# Altium project Electro_plant.PrjPcb
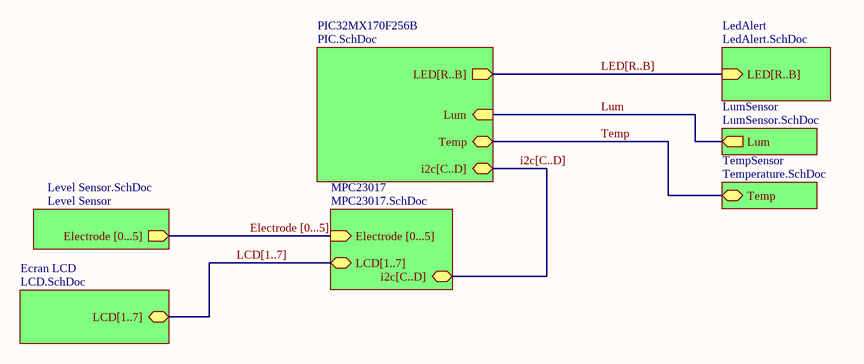
[diagram p0: ElectroPlantoE.SchDoc]
5 sheets, 43 parts. Net scope: hierarchical (ports join the sheet entries above them; power ports are global).
Sheets:
  ElectroPlantoE.SchDoc
    MPC23017 = MPC23017.SchDoc
    Level Sensor = Level Sensor.SchDoc
  BarGraph.SchDoc
  SoilMoisture.SchDoc

## Sheet ElectroPlantoE.SchDoc
size A

### Sub-sheets
Ecran LCD = LCD.SchDoc (file not in this document): LCD[1..7] (bidir)
LedAlert = LedAlert.SchDoc (file not in this document): LED[R..B] (in)
Level Sensor = Level Sensor.SchDoc: Electrode [0...5] (out)
LumSensor = LumSensor.SchDoc (file not in this document): Lum (out)
MPC23017 = MPC23017.SchDoc: i2c[C..D] (bidir), Electrode [0...5] (in), LCD[1..7] (bidir)
PIC32MX170F256B = PIC.SchDoc (file not in this document): LED[R..B] (out), Lum (in), Temp, i2c[C..D] (bidir)
TempSensor = Temperature.SchDoc (file not in this document): Temp (bidir)

### Nets
Lum: sheet PIC32MX170F256B/Lum, sheet LumSensor/Lum
Temp: sheet PIC32MX170F256B/Temp, sheet TempSensor/Temp

### Buses and harness runs
bus Electrode [0...5] = sheet Level Sensor/Electrode [0...5] = sheet MPC23017/Electrode [0...5]
bus i2c[C..D] = sheet MPC23017/i2c[C..D] = sheet PIC32MX170F256B/i2c[C..D]
bus LCD[1..7] = sheet Ecran LCD/LCD[1..7] = sheet MPC23017/LCD[1..7]
bus LED[R..B] = sheet LedAlert/LED[R..B] = sheet PIC32MX170F256B/LED[R..B]

## Sheet MPC23017.SchDoc
size A
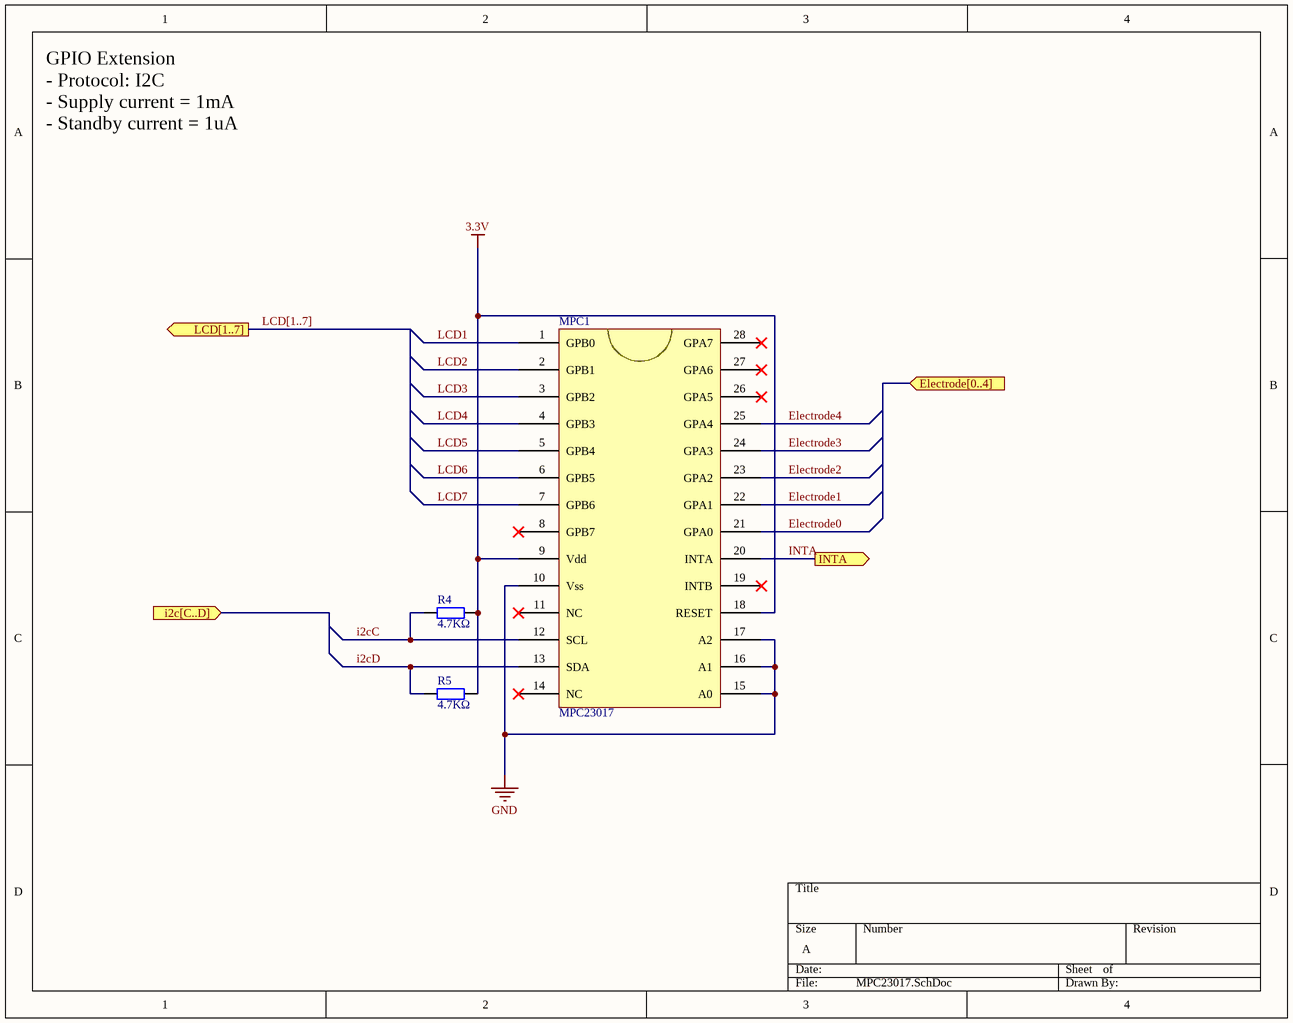
[diagram p1: MPC23017.SchDoc]

### Parts
MPC1  MPC23017
R4  4.7KΩ  [AXIAL-0.4]
R5  4.7KΩ  [AXIAL-0.4]

### Ports
Electrode[0..4] (in), i2c[C..D] (in), INTA (out), LCD[1..7] (out)

### Nets
3.3V: MPC1.9(Vdd) MPC1.10(Vss) MPC1.15(A0) MPC1.16(A1) MPC1.17(A2) MPC1.18(RESET) R4.1 R5.1  [also labelled GND]
Electrode0: MPC1.21(GPA0)
Electrode1: MPC1.22(GPA1)
Electrode2: MPC1.23(GPA2)
Electrode3: MPC1.24(GPA3)
Electrode4: MPC1.25(GPA4)
i2cC: MPC1.12(SCL) R4.2
i2cD: MPC1.13(SDA) R5.2
INTA: MPC1.20(INTA) ; port INTA
LCD1: MPC1.1(GPB0)
LCD2: MPC1.2(GPB1)
LCD3: MPC1.3(GPB2)
LCD4: MPC1.4(GPB3)
LCD5: MPC1.5(GPB4)
LCD6: MPC1.6(GPB5)
LCD7: MPC1.7(GPB6)

Not connected (* = marked no-connect by the designer): MPC1 8(GPB7)* 11(NC)* 14(NC)* 19(INTB)* 26(GPA5)* 27(GPA6)* 28(GPA7)*

### Buses and harness runs
bus LCD[1..7] = port LCD[1..7]

### Notes on the sheet
- GPIO Extension
  - Protocol: I2C
  - Supply current = 1mA
  - Standby current = 1uA

### Library data of the parts
MPC1 = Component_1
R4 R5 = Res2: Resistor; Value: 1K; Published: 8-Jun-2000; LatestRevisionDate: 17-Jul-2002; LatestRevisionNote: Re-released for DXP Platform.; PackageReference: AXIAL-0.4; Publisher: Altium Limited; PackageDescription: Axial Device, Thru-Hole; 2 Leads; 0.4 in Pin Spacing

## Sheet Level Sensor.SchDoc
size A
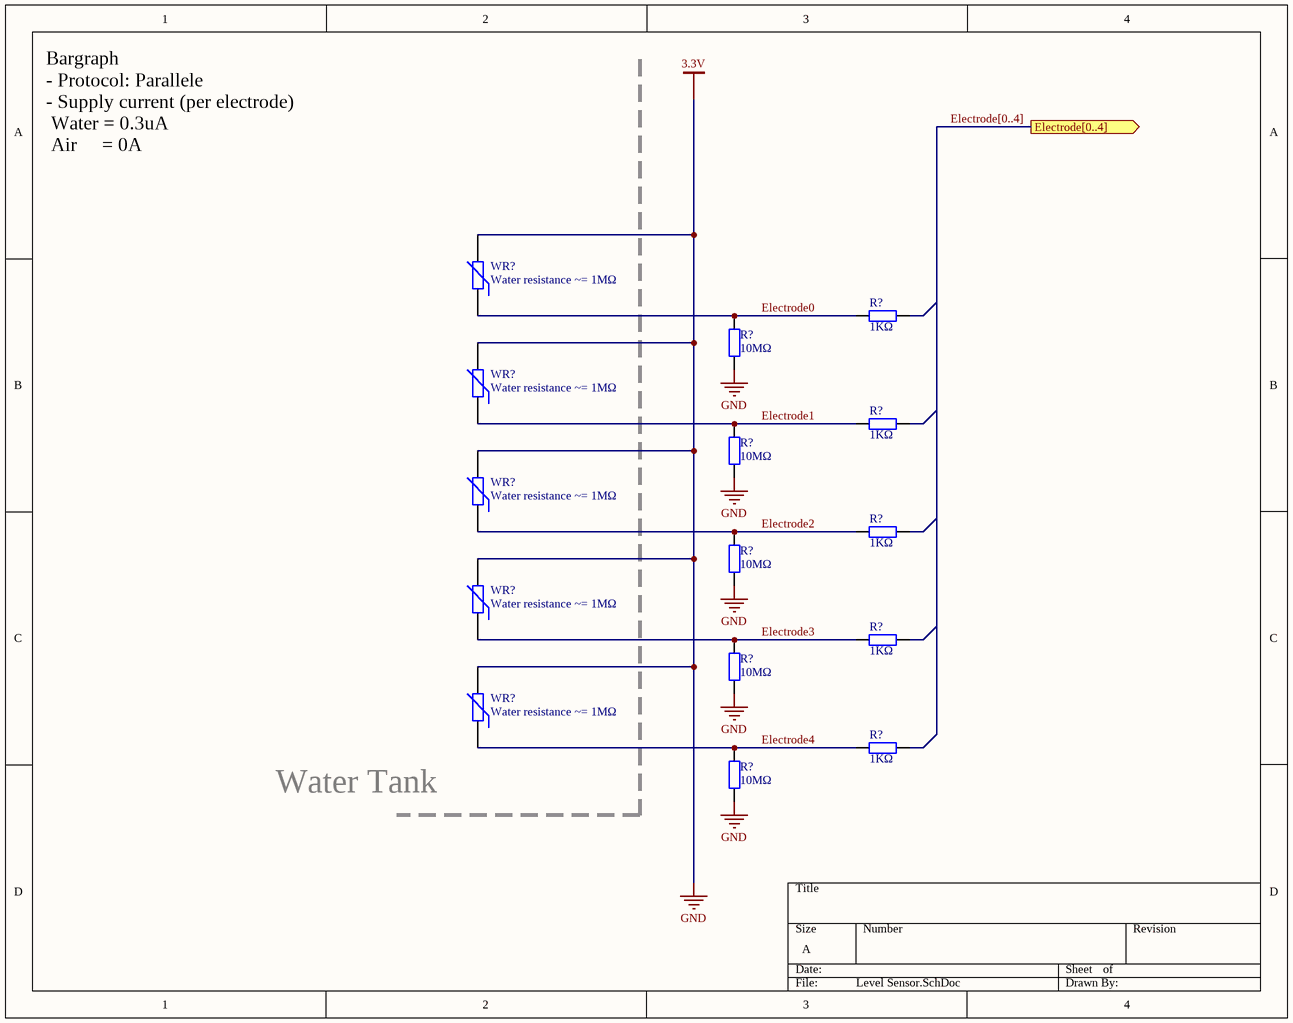
[diagram p2: Level Sensor.SchDoc]

### Parts
(Parts that share a designator on the sheet are numbered #1, #2 ... from top to bottom, then left to right.)
R?#1  1KΩ  [AXIAL-0.4]
R?#2  10MΩ  [AXIAL-0.4]
R?#3  1KΩ  [AXIAL-0.4]
R?#4  10MΩ  [AXIAL-0.4]
R?#5  1KΩ  [AXIAL-0.4]
R?#6  10MΩ  [AXIAL-0.4]
R?#7  1KΩ  [AXIAL-0.4]
R?#8  10MΩ  [AXIAL-0.4]
R?#9  1KΩ  [AXIAL-0.4]
R?#10  10MΩ  [AXIAL-0.4]
WR?#1  Water resistance ~= 1MΩ  [6-0805_N]
WR?#2  Water resistance ~= 1MΩ  [6-0805_N]
WR?#3  Water resistance ~= 1MΩ  [6-0805_N]
WR?#4  Water resistance ~= 1MΩ  [6-0805_N]
WR?#5  Water resistance ~= 1MΩ  [6-0805_N]

### Ports
Electrode[0..4] (out)

### Nets
3.3V: R?#2.1 R?#4.1 R?#6.1 R?#8.1 R?#10.1 WR?#1.2 WR?#2.2 WR?#3.2 WR?#4.2 WR?#5.2  [also labelled GND]
Electrode0: R?#1.2 R?#2.2 WR?#1.1
Electrode1: R?#3.2 R?#4.2 WR?#2.1
Electrode2: R?#5.2 R?#6.2 WR?#3.1
Electrode3: R?#7.2 R?#8.2 WR?#4.1
Electrode4: R?#9.2 R?#10.2 WR?#5.1

Not connected (* = marked no-connect by the designer): R?#1 1; R?#3 1; R?#5 1; R?#7 1; R?#9 1

### Buses and harness runs
bus Electrode[0..4] = port Electrode[0..4]

### Notes on the sheet
- Bargraph
  - Protocol: Parallele
  - Supply current (per electrode)
  Water = 0.3uA
  Air     = 0A
- Water Tank

### Library data of the parts
R?#1-R?#10 = Res2: Resistor; Value: 1K; Published: 8-Jun-2000; LatestRevisionDate: 17-Jul-2002; LatestRevisionNote: Re-released for DXP Platform.; PackageReference: AXIAL-0.4; Publisher: Altium Limited; PackageDescription: Axial Device, Thru-Hole; 2 Leads; 0.4 in Pin Spacing
WR?#1-WR?#5 = Res Varistor: Varistor (Voltage-Sensitive Resistor); Published: 24-Mar-1999; LatestRevisionDate: 29-May-2009; LatestRevisionNote: IPC-7351 Footprint Added.; PackageVersion: Mar-2003; PackageReference: 6-0805; Publisher: Altium Limited; PackageDescription: Chip Resistor 0805 Case Size; Code_IPC: RESC2012

## Sheet BarGraph.SchDoc
size A
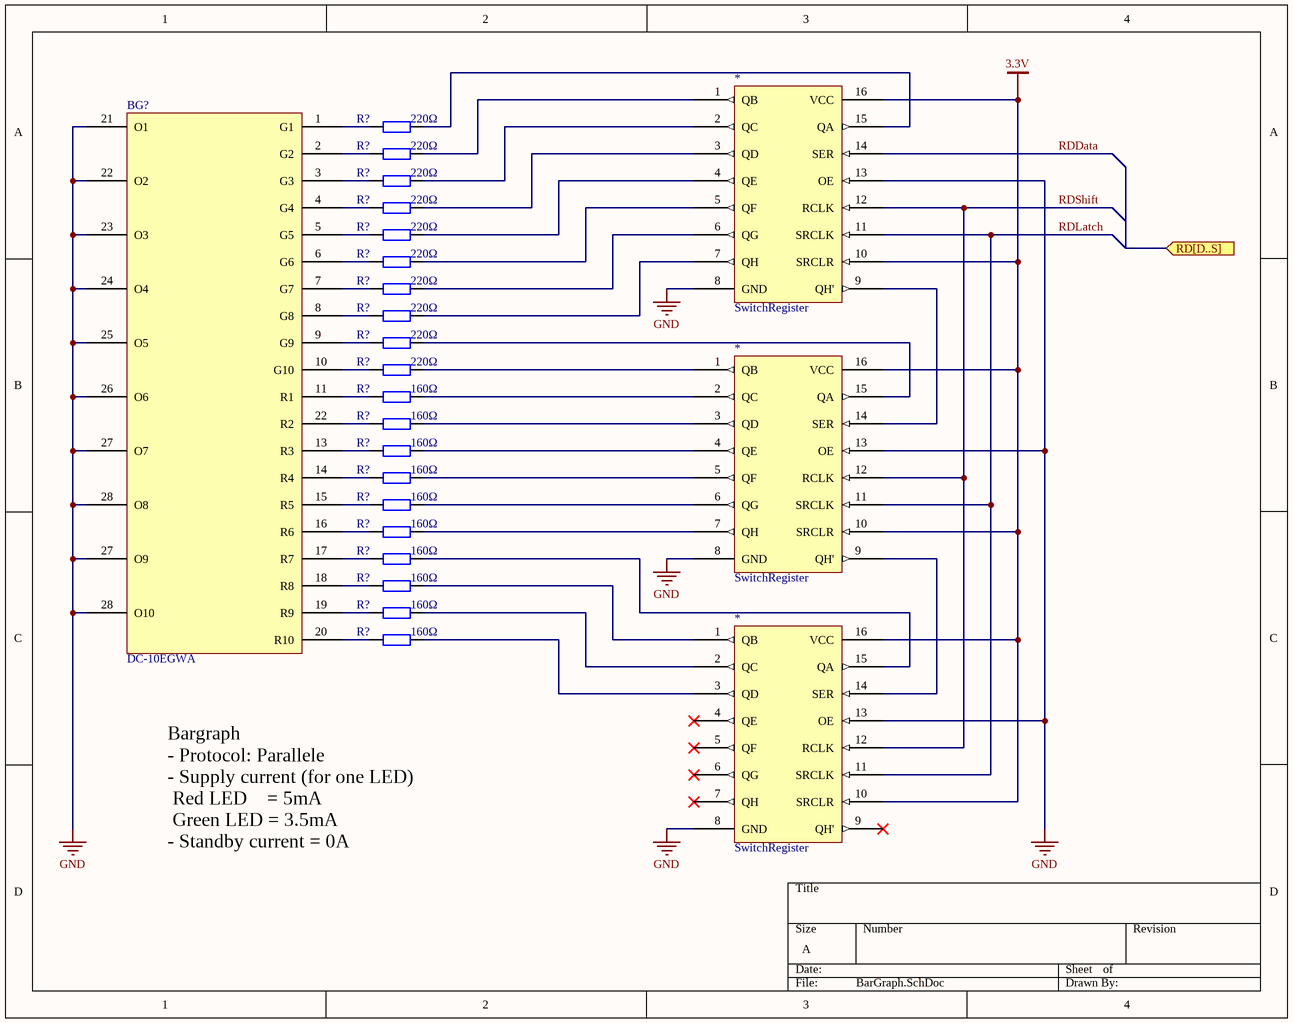
[diagram p3: BarGraph.SchDoc]

### Parts
(Parts that share a designator on the sheet are numbered #1, #2 ... from top to bottom, then left to right.)
*#1  SwitchRegister
*#2  SwitchRegister
*#3  SwitchRegister
BG?  DC-10EGWA
R?#11  220Ω  [AXIAL-0.4]
R?#12  220Ω  [AXIAL-0.4]
R?#13  220Ω  [AXIAL-0.4]
R?#14  220Ω  [AXIAL-0.4]
R?#15  220Ω  [AXIAL-0.4]
R?#16  220Ω  [AXIAL-0.4]
R?#17  220Ω  [AXIAL-0.4]
R?#18  220Ω  [AXIAL-0.4]
R?#19  220Ω  [AXIAL-0.4]
R?#20  220Ω  [AXIAL-0.4]
R?#21  160Ω  [AXIAL-0.4]
R?#22  160Ω  [AXIAL-0.4]
R?#23  160Ω  [AXIAL-0.4]
R?#24  160Ω  [AXIAL-0.4]
R?#25  160Ω  [AXIAL-0.4]
R?#26  160Ω  [AXIAL-0.4]
R?#27  160Ω  [AXIAL-0.4]
R?#28  160Ω  [AXIAL-0.4]
R?#29  160Ω  [AXIAL-0.4]
R?#30  160Ω  [AXIAL-0.4]

### Ports
RD[D..S] (in)

### Nets
3.3V: *#1.8(GND) *#1.10(SRCLR) *#1.13(OE) *#1.16(VCC) *#2.8(GND) *#2.10(SRCLR) *#2.13(OE) *#2.16(VCC) *#3.8(GND) *#3.10(SRCLR) *#3.13(OE) *#3.16(VCC) BG?.21(O1) BG?.22(O2) BG?.23(O3) BG?.24(O4) BG?.25(O5) BG?.26(O6) BG?.27(O7) BG?.28(O8)  [also labelled GND]
RDData: *#1.14(SER)
RDLatch: *#1.11(SRCLK) *#2.11(SRCLK) *#3.11(SRCLK)
RDShift: *#1.12(RCLK) *#2.12(RCLK) *#3.12(RCLK)
Net*#1_1: *#1.1(QB) R?#12.2
Net*#1_2: *#1.2(QC) R?#13.2
Net*#1_3: *#1.3(QD) R?#14.2
Net*#1_4: *#1.4(QE) R?#15.2
Net*#1_5: *#1.5(QF) R?#16.2
Net*#1_6: *#1.6(QG) R?#17.2
Net*#1_7: *#1.7(QH) R?#18.2
Net*#1_9: *#1.9(QH') *#2.14(SER)
Net*#1_15: *#1.15(QA) R?#11.2
Net*#2_1: *#2.1(QB) R?#20.2
Net*#2_2: *#2.2(QC) R?#21.2
Net*#2_3: *#2.3(QD) R?#22.2
Net*#2_4: *#2.4(QE) R?#23.2
Net*#2_5: *#2.5(QF) R?#24.2
Net*#2_6: *#2.6(QG) R?#25.2
Net*#2_7: *#2.7(QH) R?#26.2
Net*#2_9: *#2.9(QH') *#3.14(SER)
Net*#2_15: *#2.15(QA) R?#19.2
Net*#3_1: *#3.1(QB) R?#28.2
Net*#3_2: *#3.2(QC) R?#29.2
Net*#3_3: *#3.3(QD) R?#30.2
Net*#3_15: *#3.15(QA) R?#27.2
NetBG?_1: BG?.1(G1) R?#11.1
NetBG?_2: BG?.2(G2) R?#12.1
NetBG?_3: BG?.3(G3) R?#13.1
NetBG?_4: BG?.4(G4) R?#14.1
NetBG?_5: BG?.5(G5) R?#15.1
NetBG?_6: BG?.6(G6) R?#16.1
NetBG?_7: BG?.7(G7) R?#17.1
NetBG?_8: BG?.8(G8) R?#18.1
NetBG?_9: BG?.9(G9) R?#19.1
NetBG?_10: BG?.10(G10) R?#20.1
NetBG?_11: BG?.11(R1) R?#21.1
NetBG?_13: BG?.13(R3) R?#23.1
NetBG?_14: BG?.14(R4) R?#24.1
NetBG?_15: BG?.15(R5) R?#25.1
NetBG?_16: BG?.16(R6) R?#26.1
NetBG?_17: BG?.17(R7) R?#27.1
NetBG?_18: BG?.18(R8) R?#28.1
NetBG?_19: BG?.19(R9) R?#29.1
NetBG?_20: BG?.20(R10) R?#30.1
NetBG?_22: BG?.22(R2) R?#22.1

Not connected (* = marked no-connect by the designer): *#3 4(QE)* 5(QF)* 6(QG)* 7(QH)* 9(QH')*

### Notes on the sheet
- Bargraph
  - Protocol: Parallele
  - Supply current (for one LED)
  Red LED    = 5mA
  Green LED = 3.5mA
  - Standby current = 0A

### Library data of the parts
*#1-*#3 BG? = Component_1
R?#11-R?#30 = Res2: Resistor; Value: 1K; Published: 8-Jun-2000; LatestRevisionDate: 17-Jul-2002; LatestRevisionNote: Re-released for DXP Platform.; PackageReference: AXIAL-0.4; Publisher: Altium Limited; PackageDescription: Axial Device, Thru-Hole; 2 Leads; 0.4 in Pin Spacing

## Sheet SoilMoisture.SchDoc
size A
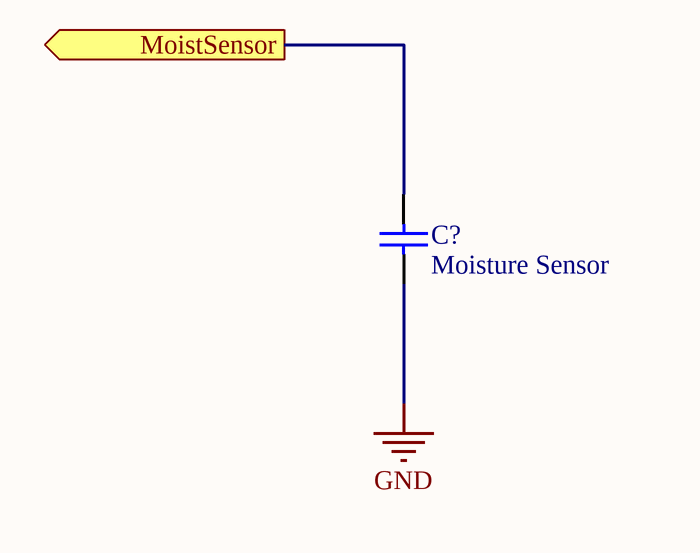
[diagram p4: SoilMoisture.SchDoc]

### Parts
C?  Moisture Sensor  [RAD-0.3]

### Ports
MoistSensor (out)

### Nets
GND: C?.1  [project net 3.3V]
NetC?_2: C?.2 ; port MoistSensor

### Library data of the parts
C? = Cap: Capacitor; Value: 100pF; Published: 8-Jun-2000; LatestRevisionDate: 17-Jul-2002; LatestRevisionNote: Re-released for DXP Platform.; PackageReference: RAD-0.3; Publisher: Altium Limited; PackageDescription: Radial Cap, Thru-Hole; 2 Leads; 0.3 in Pin Spacing

## Nets that join several sheets
3.3V: MPC23017 (8 pins), Level Sensor (10 pins), BarGraph (20 pins), SoilMoisture (C?.1)